# EAGLE design BaseSMD (EAGLE 7.3.0)
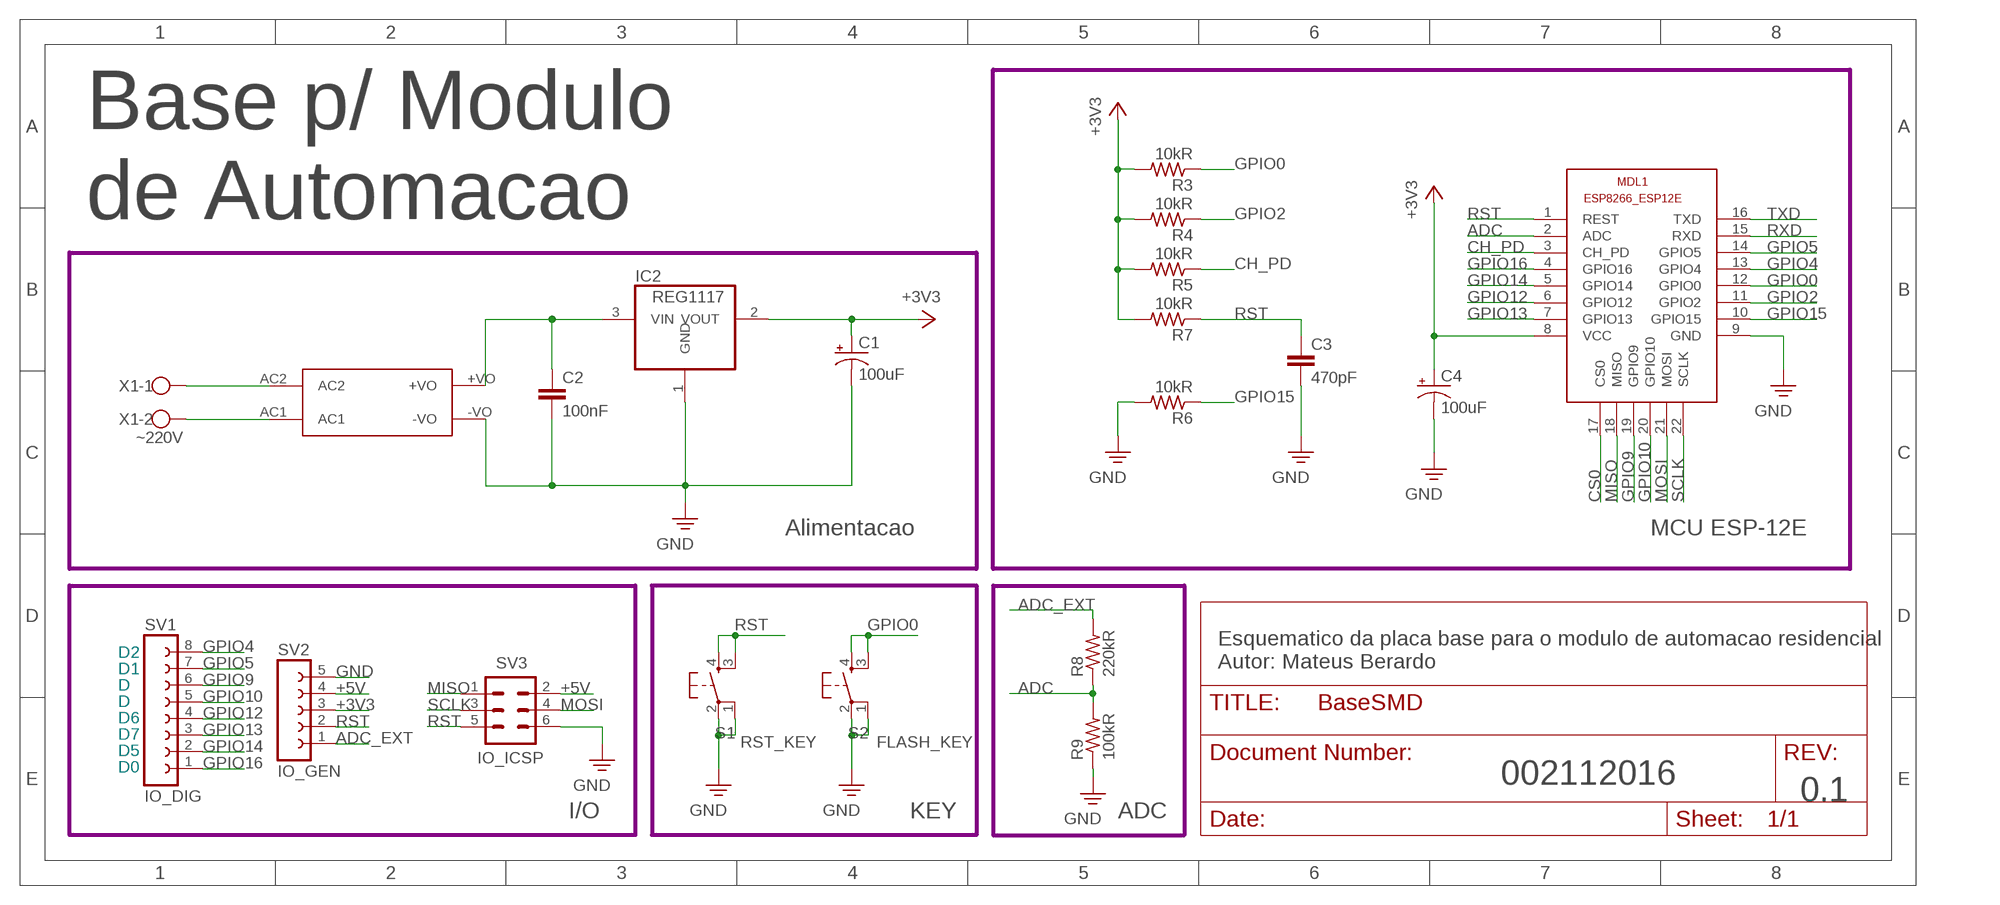
[diagram p0: schematic, sheet 1]

## Parts
C1  100uF  CPOL-US153CLV-0810  [153CLV-0810]
C2  100nF  C-EUC1206  [C1206]
C3  470pF  C-EUC1206  [C1206]
C4  100uF  CPOL-US153CLV-0810  [153CLV-0810]
IC2  REG1117  [SOT223]
MDL1  MCU ESP  ESP8266-12EESP8266-ESP12E  [ESP8266-ESP12E]
R3  10kR  R-US_M1206  [M1206]
R4  10kR  R-US_M1206  [M1206]
R5  10kR  R-US_M1206  [M1206]
R6  10kR  R-US_M1206  [M1206]
R7  10kR  R-US_M1206  [M1206]
R8  220kR  R-US_R1206  [R1206]
R9  100kR  R-US_R1206  [R1206]
S1  RST_KEY  10-XX4X4SMD  [BT4X4]
S2  FLASH_KEY  10-XX4X4SMD  [BT4X4]
SV1  IO_DIG  FE08-1  [FE08]
SV2  IO_GEN  FE05-1  [FE05-1]
SV3  IO_ICSP  MA03-2  [MA03-2]
U$1  HLK-PM01  [HLK-PM01]
X1  ~220V  W237-102  [W237-102]

## Nets
+3V3: C1.+ C4.+ IC2.2(VOUT) MDL1.8(VCC) R3.2 R4.2 R5.2 R7.2 SV2.3
+5V: C2.1 IC2.3(VIN) SV2.4 SV3.2 U$1.+VO
ADC: MDL1.2(ADC) R8.1 R9.2
ADC_EXT: R8.2 SV2.1
CH_PD: MDL1.3(CH_PD) R5.1
CS0: MDL1.17(CS0)
GND: C1.- C2.2 C3.2 C4.- IC2.1(GND) MDL1.9(GND) R6.2 R9.1 S1.1 S1.2(P) S2.1 S2.2(P) SV2.5 SV3.6 U$1.-VO
GPIO0: MDL1.12(GPIO0) R3.1 S2.3(S1) S2.4(S)
GPIO2: MDL1.11(GPIO2) R4.1
GPIO4: MDL1.13(GPIO4) SV1.8
GPIO5: MDL1.14(GPIO5) SV1.7
GPIO9: MDL1.19(GPIO9) SV1.6
GPIO10: MDL1.20(GPIO10) SV1.5
GPIO12: MDL1.6(GPIO12) SV1.4
GPIO13: MDL1.7(GPIO13) SV1.3
GPIO14: MDL1.5(GPIO14) SV1.2
GPIO15: MDL1.10(GPIO15) R6.1
GPIO16: MDL1.4(GPIO16) SV1.1
MISO: MDL1.18(MISO) SV3.1
MOSI: MDL1.21(MOSI) SV3.4
N$3: U$1.AC2 X1.1
N$4: U$1.AC1 X1.2
RST: C3.1 MDL1.1(REST) R7.1 S1.3(S1) S1.4(S) SV2.2 SV3.5
RXD: MDL1.15(RXD)
SCLK: MDL1.22(SCLK) SV3.3
TXD: MDL1.16(TXD)

## Notes on the sheet
- Base p/ Modulo 
  de Automacao
- Alimentacao | MCU ESP-12E
- D2
- Esquematico da placa base para o modulo de automacao residencial
  Autor: Mateus Berardo
- D1
- D
- D
- D6
- D7
- D5
- D0
- 002112016
- 0.1
- I/O | KEY | ADC

## Library data of the parts
C1 C4 = rcl:CPOL-US: POLARIZED CAPACITOR, American symbol
C2 C3 = rcl:C-EU: CAPACITOR, European symbol
IC2 = burr-brown:REG1117: 800mA and 1A Low Dropout (LDO) Positive Regulator 1.8V, 2.5V, 2.85V, 3.3V, 5V, and Adj; MPN: REG1117; OC_FARNELL: 1097566; OC_NEWARK: 14P6981
MDL1 = ESP8266-ESP12E:ESP8266-12E: ESP8266-12E with additional I/O and GPIO04/05 corrected The author cannot warrant that this library is free from error or will meet your specific requirements. Created by PuceBaboon.com. Komagane, Nagano, JAPAN
R3-R9 = resistor:R-US_: RESISTOR, American symbol
S1 S2 = buttons:10-XX: OMRON SWITCH
SV1 = con-lsta:FE08-1: FEMALE HEADER; OC_FARNELL: unknown; OC_NEWARK: unknown
SV2 = con-lsta:FE05-1: FEMALE HEADER; OC_FARNELL: unknown; OC_NEWARK: unknown
SV3 = con-lstb:MA03-2: PIN HEADER; OC_FARNELL: unknown; OC_NEWARK: unknown
U$1 = hlk-pm01:HLK-PM01
X1 = con-wago-500:W237-102: WAGO SCREW CLAMP; MPN: 237-102; OC_FARNELL: unknown; OC_NEWARK: 70K9898

## Board
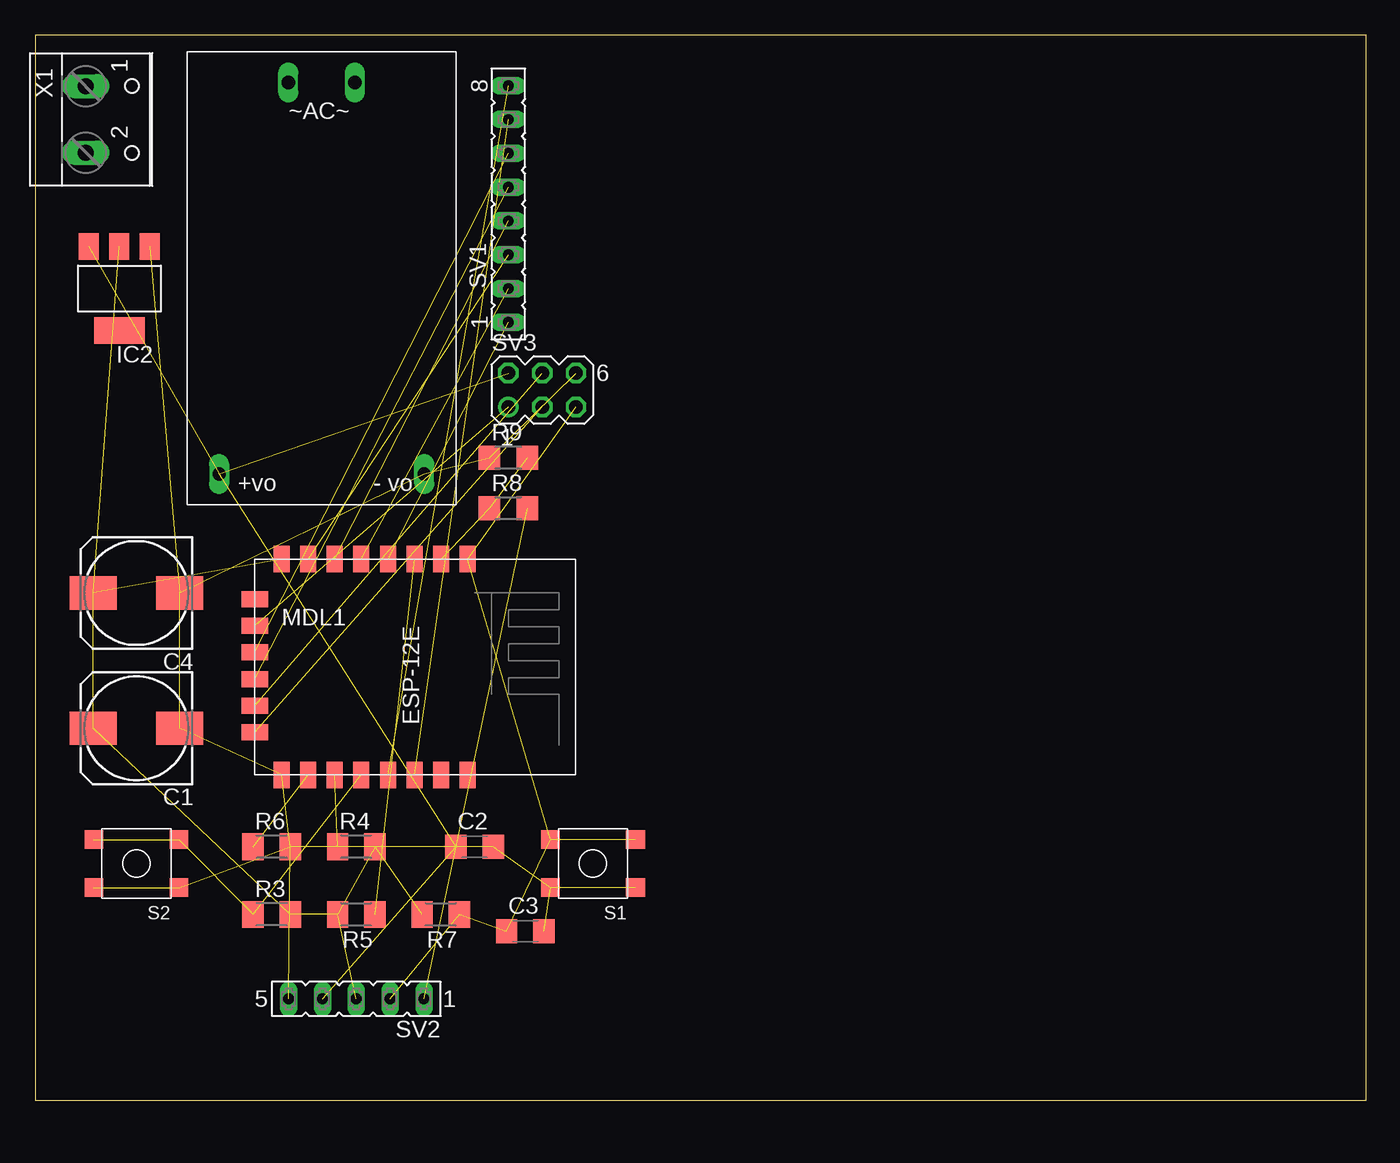
[diagram p1: board, top side]
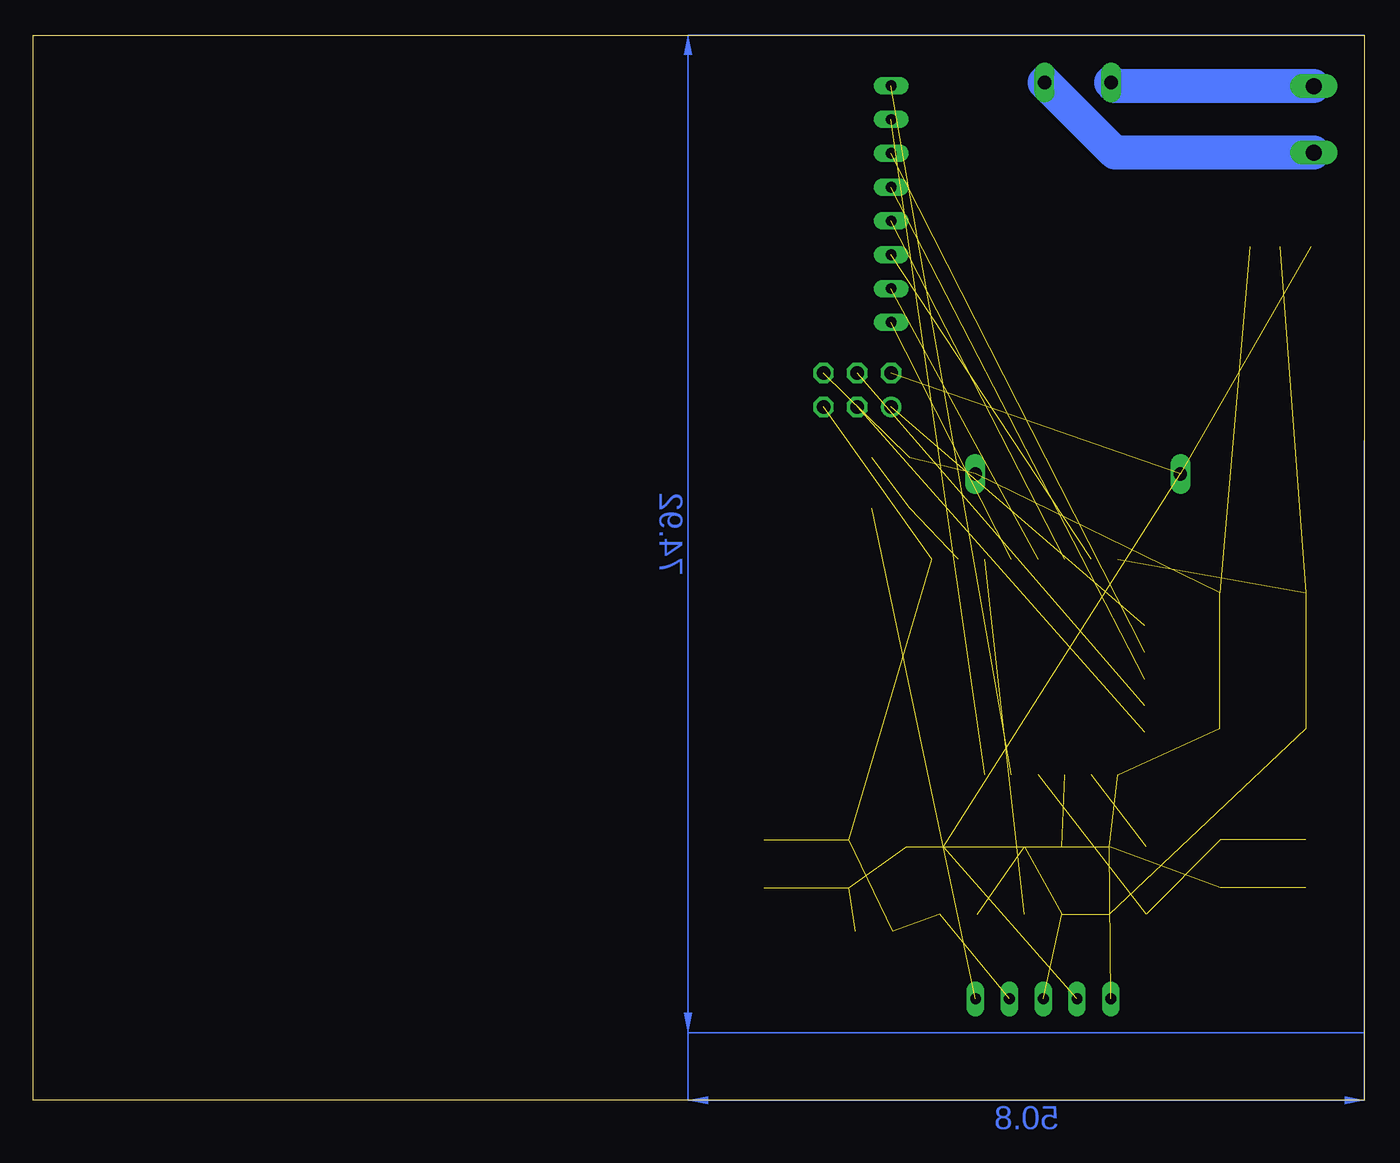
[diagram p2: board, bottom side, seen from below]

Size 100 x 80 mm. Coordinates in mm from the lower left corner, seen from the top.
Outline: 0,0 100,0 100,80 0,80 0,0
Copper layers (1*16): Top 0.035mm / dielectric 1.5mm / Bottom 0.035mm
Design rules "default": minimum track width 10mil, minimum drill 24mil, track to track 8mil, track to pad 8mil, pad to pad 8mil, via to via 8mil, smd to smd 8mil, copper to edge 40mil, drill to drill 8mil, minimum pad ring 10mil, minimum via ring 8mil, stop-mask expansion 4mil, vias tented up to drill 0mil, thermal gap 10mil

### Footprints (pad centres in the part's own frame; a part is rotated, then mirrored left to right if it is on the bottom)
153CLV-0810 = smd 3.5 x 2.5: + 3.25,0; - -3.25,0
C1206 = smd 1.6 x 1.8: 1 -1.4,0; 2 1.4,0
SOT223 = smd 1.499 x 2.007: 1 -2.261,-3.15; 2 0.025,-3.15; 3 2.311,-3.15 | smd 3.81 x 2.007: 4 0,3.15
ESP8266-ESP12E = smd 2 x 1.2: 1 -7.62,5.84; 2 -7.62,3.84; 3 -7.62,1.84; 4 -7.62,-0.16; 5 -7.62,-2.16; 6 -7.62,-4.16; 7 -7.62,-6.16; 8 -7.62,-8.16; 9 8.58,-8.16; 10 8.58,-6.16; 11 8.58,-4.16; 12 8.58,-2.16; 13 8.58,-0.16; 14 8.58,1.84; 15 8.58,3.84; 16 8.58,5.84 | smd 1.2 x 2: 17 -4.62,-10.16; 18 -2.62,-10.16; 19 -0.62,-10.16; 20 1.38,-10.16; 21 3.38,-10.16; 22 5.38,-10.16
M1206 = smd 1.6 x 2: 1 -1.4,0; 2 1.4,0
R1206 = smd 1.6 x 1.803: 1 -1.422,0; 2 1.422,0
BT4X4 = smd 1.4 x 1.4: 1 -1.8,3.2; 2 -1.8,-3.2; 3 1.8,3.2; 4 1.8,-3.2
FE08 = drill 0.813 long: 1 -8.89,0; 2 -6.35,0; 3 -3.81,0; 4 -1.27,0; 5 1.27,0; 6 3.81,0; 7 6.35,0; 8 8.89,0
FE05-1 = drill 0.813 long: 1 -5.08,0; 2 -2.54,0; 3 0,0; 4 2.54,0; 5 5.08,0
MA03-2 = drill 1.016: 1 -2.54,-1.27 | drill 1.016 octagon: 2 -2.54,1.27; 3 0,-1.27; 4 0,1.27; 5 2.54,-1.27; 6 2.54,1.27
HLK-PM01 = drill 1 long: +VO 31.7,2.4; -VO 31.7,17.8; AC1 2.3,12.6; AC2 2.3,7.6
W237-102 = drill 1.194 long: 1 -2.5,-1.27; 2 2.5,-1.27

### Placement (x,y rotation side)
C1  7.62,27.94 180 top
C2  33.02,19.05 0 top
C3  36.83,12.7 0 top
C4  7.62,38.1 180 top
IC2  6.35,60.96 180 top
MDL1  26.67,33.02 270 top
R3  17.78,13.97 0 top
R4  24.13,19.05 0 top
R5  24.13,13.97 180 top
R6  17.78,19.05 0 top
R7  30.48,13.97 180 top
R8  35.56,44.45 0 top
R9  35.56,48.26 0 top
S1  41.91,17.78 90 top
S2  7.62,17.78 90 top
SV1  35.56,67.31 90 top
SV2  24.13,7.62 180 top
SV3  38.1,53.34 0 top
U$1  11.43,78.74 270 top
X1  5.08,73.66 270 top

### Tracks (layer width: path | path; a pad name or v marks a point on that pad's centre or on a via)
+3V3  (8 unrouted)
+5V  (4 unrouted)
ADC  (2 unrouted)
ADC_EXT  (1 unrouted)
CH_PD  (1 unrouted)
GND  (14 unrouted)
GPIO0  (3 unrouted)
GPIO2  (1 unrouted)
GPIO4  (1 unrouted)
GPIO5  (1 unrouted)
GPIO9  (1 unrouted)
GPIO10  (1 unrouted)
GPIO12  (1 unrouted)
GPIO13  (1 unrouted)
GPIO14  (1 unrouted)
GPIO15  (1 unrouted)
GPIO16  (1 unrouted)
MISO  (1 unrouted)
MOSI  (1 unrouted)
N$3
  Bottom 2.54: X1.1 18.75,76.16 U$1.AC2
N$4
  Bottom 2.54: X1.2 18.75,71.16 U$1.AC1
RST  (6 unrouted)
SCLK  (1 unrouted)
(copper drawn outside any net)
  shapes: Bottom area x2